# Altium schematic sheet 04-External_Connectors.SchDoc
size A4; Author: Fabian Castaño; CompanyName: GIBIC Tech-Hub; Engineer: Fabian Castaño; Organization: Universidad de Antioquia; Address1: UdeA; Address2: Medellín; Address3: Antioquia; Address4: Colombia 050010
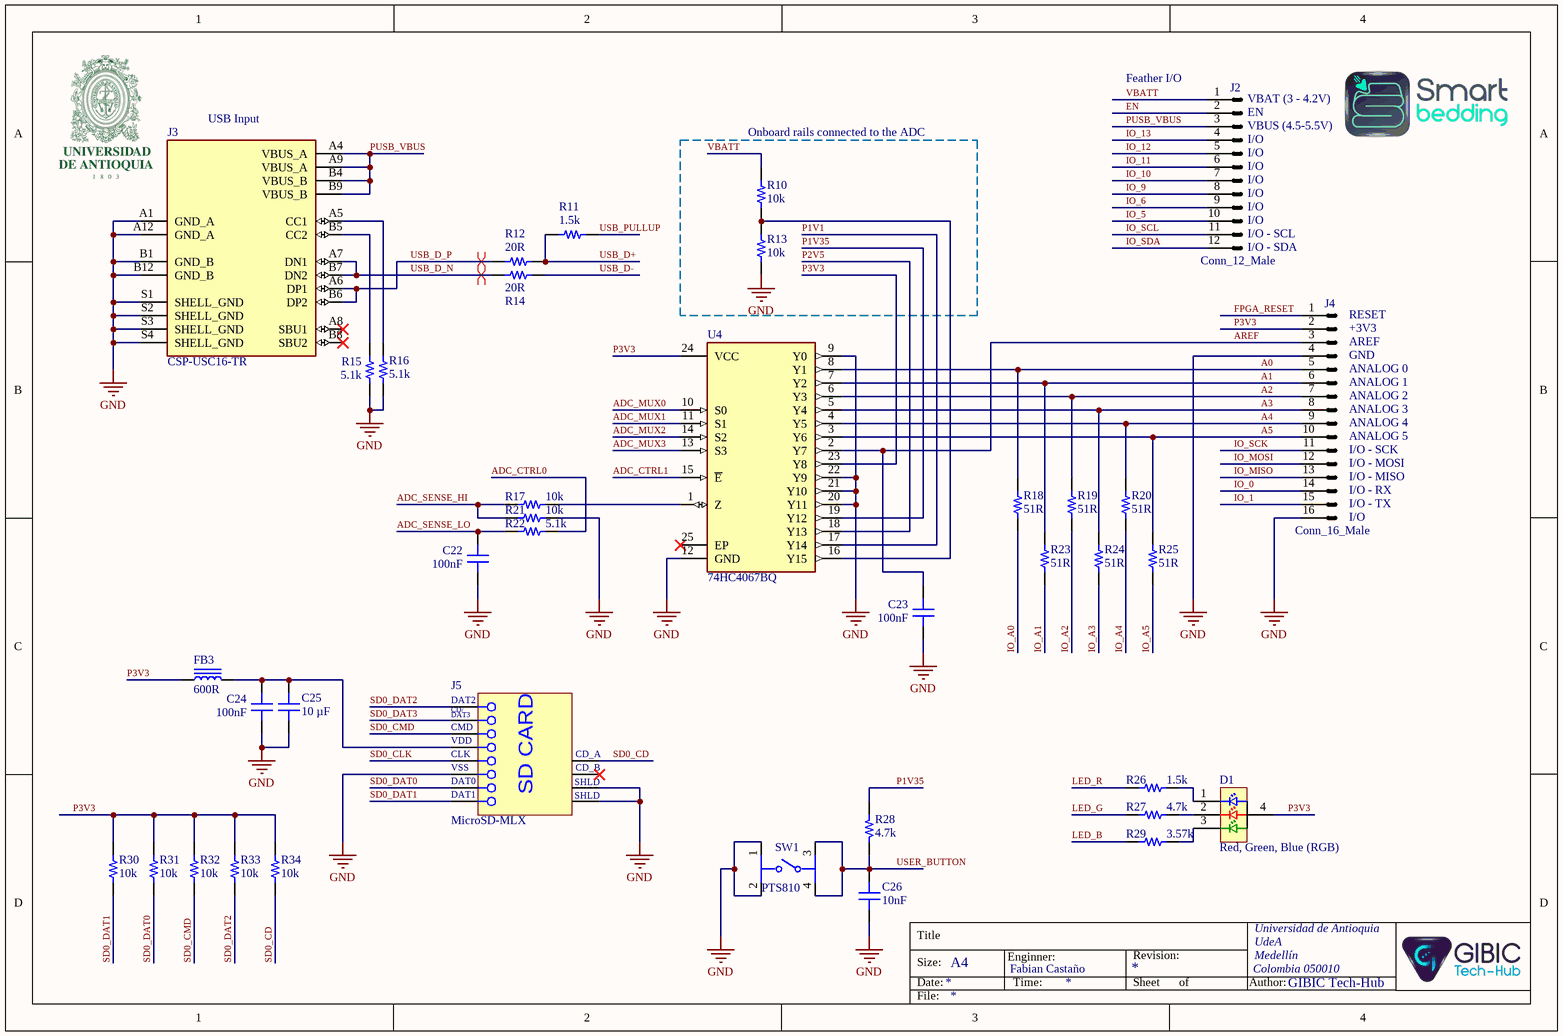
[diagram p0: 04-External_Connectors.SchDoc]

## Parts
C22  100nF  [CAP 0201_0603]
C23  100nF  [CAP 0201_0603]
C24  100nF  [CAP 0201_0603]
C25  10 µF  [CAP 0402_1005]
C26  10nF  [CAP 0201_0603]
D1  Red, Green, Blue (RGB)  [Citizen CL-505S-X-SD-T]
FB3  600R  [IND 0402_1005 RF WW]
J2  Conn_12_Male  [Conn_12_Male]
J3  CSP-USC16-TR  [VALCON_CSP-USC16-TR]
J4  Conn_16_Male  [CONN_16_MALE]
J5  MicroSD-MLX  [MOLEX-MicroSd]
R10  10k  [RES 0201_0603]
R11  1.5k  [RES 0201_0603]
R12  20R  [RES 0201_0603]
R13  10k  [RES 0201_0603]
R14  20R  [RES 0201_0603]
R15  5.1k  [RES 0201_0603]
R16  5.1k  [RES 0201_0603]
R17  10k  [RES 0201_0603]
R18  51R  [RES 0201_0603]
R19  51R  [RES 0201_0603]
R20  51R  [RES 0201_0603]
R21  10k  [RES 0201_0603]
R22  5.1k  [RES 0201_0603]
R23  51R  [RES 0201_0603]
R24  51R  [RES 0201_0603]
R25  51R  [RES 0201_0603]
R26  1.5k  [RES 0201_0603]
R27  4.7k  [RES 0201_0603]
R28  4.7k  [RES 0201_0603]
R29  3.57k  [RES 0201_0603]
R30  10k  [RES 0201_0603]
R31  10k  [RES 0201_0603]
R32  10k  [RES 0201_0603]
R33  10k  [RES 0201_0603]
R34  10k  [RES 0201_0603]
SW1  PTS810  [PCBComponent_1]
U4  74HC4067BQ  [QFN50P550X350X100-25N410X210]

## Blocks framed on the sheet
Onboard rails connected to the ADC: R10 R13

## Nets
GND: C22.1 C23.1 C24.1 C25.1 C26.1 J3.A1(GND_A) J3.A12(GND_A) J3.B1(GND_B) J3.B12(GND_B) J3.S1(SHELL_GND) J3.S2(SHELL_GND) J3.S3(SHELL_GND) J3.S4(SHELL_GND) J4.4 J4.16 J5.6(VSS) J5.11(SHLD1) J5.12(SHLD2) R13.1 R15.1 R16.1 R21.1 SW1.1 SW1.2 U4.9(Y0) U4.12(GND) U4.20(Y11) U4.21(Y10) U4.22(Y9)
A0: J4.5 R18.2 U4.8(Y1)
A1: J4.6 R23.2 U4.7(Y2)
A2: J4.7 R19.2 U4.6(Y3)
A3: J4.8 R24.2 U4.5(Y4)
A4: J4.9 R20.2 U4.4(Y5)
A5: J4.10 R25.2 U4.3(Y6)
ADC_CTRL0: R22.1
ADC_CTRL1: U4.15(~{E})
ADC_MUX0: U4.10(S0)
ADC_MUX1: U4.11(S1)
ADC_MUX2: U4.14(S2)
ADC_MUX3: U4.13(S3)
ADC_SENSE_HI: R17.2 R21.2
ADC_SENSE_LO: C22.2 R22.2
AREF: C23.2 J4.3 U4.2(Y7)
EN: J2.2
FPGA_RESET: J4.1
IO_0: J4.14
IO_1: J4.15
IO_5: J2.10
IO_6: J2.9
IO_9: J2.8
IO_10: J2.7
IO_11: J2.6
IO_12: J2.5
IO_13: J2.4
IO_A0: R18.1
IO_A1: R23.1
IO_A2: R19.1
IO_A3: R24.1
IO_A4: R20.1
IO_A5: R25.1
IO_MISO: J4.13
IO_MOSI: J4.12
IO_SCK: J4.11
IO_SCL: J2.11
IO_SDA: J2.12
LED_B: R29.2
LED_G: R27.2
LED_R: R26.2
P1V1: U4.17(Y14)
P1V35: R28.2 U4.19(Y12)
P2V5: U4.18(Y13)
P3V3: D1.4(A3) FB3.1 J4.2 R30.2 R31.2 R32.2 R33.2 R34.2 U4.23(Y8) U4.24(VCC)
PUSB_VBUS: J2.3 J3.A4(VBUS_A) J3.A9(VBUS_A) J3.B4(VBUS_B) J3.B9(VBUS_B)
SD0_CD: J5.9(CD_A) R34.1
SD0_CLK: J5.5(CLK)
SD0_CMD: J5.3(CMD) R32.1
SD0_DAT0: J5.7(DAT0) R31.1
SD0_DAT1: J5.8(DAT1) R30.1
SD0_DAT2: J5.1(DAT2) R33.1
SD0_DAT3: J5.2(CD/DAT3)
USB_D+: R11.2 R12.1
USB_D-: R14.1
USB_D_N: J3.A7(DN1) J3.B7(DN2) R14.2
USB_D_P: J3.A6(DP1) J3.B6(DP2) R12.2
USB_PULLUP: R11.1
USER_BUTTON: C26.2 R28.1 SW1.3 SW1.4
VBATT: J2.1 R10.2
NetC24_2: C24.2 C25.2 FB3.2 J5.4(VDD)
NetD1_1: D1.1(C1) R26.1
NetD1_2: D1.2(C2) R27.1
NetD1_3: D1.3(C3) R29.1
NetJ3_A5: J3.A5(CC1) R16.2
NetJ3_B5: J3.B5(CC2) R15.2
NetR10_1: R10.1 R13.2 U4.16(Y15)
NetR17_1: R17.1 U4.1(Z)

Not connected (* = marked no-connect by the designer): J3 A8(SBU1)* B8(SBU2)*; J5 10(CD_B)*; U4 25(EP)*

## Layout directives
differential pair: USB_D_N, USB_D_P

## Notes on the sheet
- (near J2) Feather I/O
- (near J2) VBAT (3 - 4.2V)
- (near J2) EN
- (near J3) USB Input
- (near J2) VBUS (4.5-5.5V)
- (near J2) I/O
- (near J2) I/O - SCL
- (near J2) I/O - SDA
- (near J4) RESET
- (near J4) +3V3
- (near J4) AREF
- (near J4) GND
- (near J4) ANALOG 0
- (near J4) ANALOG 1
- (near J4) ANALOG 2
- (near J4) ANALOG 3
- (near J4) ANALOG 4
- (near J4) ANALOG 5
- (near J4) I/O - SCK
- (near J4) I/O - MOSI
- (near J4) I/O - MISO
- (near J4) I/O - RX
- (near J4) I/O - TX
- (near J4) I/O
- Title
- Size:
- Date:
- A4
- Enginner:
- Time:
- Revision:
- Sheet
- of
- Author:
- File:
- (in symbol MicroSD-MLX) CD/; DAT3; SHLD; SD CARD

## Library data of the parts
C22-C24 = GRT033C80J104KE01J: CAP CER 0.1UF 6.3V X6S 0201; manufacturer: Murata Electronics; Capacitance: 0.1 µF; Tolerance: ±10%; Part Number: GRT033C80J104KE01J; Value: 100nF; Applications: Automotive; componentlink1description: Datasheet; componentlink1url: https://search.murata.co.jp/Ceramy/image/img/A01X/G101/ENG/GRT033C80J104KE01-01.pdf; componentlink2description: DigiKey Link; componentlink2url: https://www.digikey.com/en/products/detail/murata-electronics/GRT033C80J104KE01J/13905086; Device Package: 0201 (0603 Metric); lastupdated: 3/01/2023 8:00:58 p. m.; Lifecycle Status: Active; Minimum Order: 1; Mounting Type: Surface Mount, MLCC; Operating Temperature: -55°C ~ 105°C; Package / Case: 0201 (0603 Metric); packaging: CutTape; partid: 29730; Part Status: Active; price: 0.01; Ratings: AEC-Q200; series: GRT; Size / Dimension: 0.024" L x 0.012" W (0.60mm x 0.30mm); Supplier 1: DigiKey; Supplier Part Number 1: 490-GRT033C80J104KE01JCT-ND; Temperature Coefficient: X6S; Thickness (Max): 0.013" (0.33mm); Voltage - Rated: 6.3V
C25 = CL05A106MP8NUB8: CAP CER 10UF 10V X5R 0402; manufacturer: Samsung Electro-Mechanics; Tolerance: ±20%; Part Number: CL05A106MP8NUB8; Value: 10 µF; Applications: Acoustic Noise Reduction; Capacitance: 10 µF; componentlink1description: Datasheet; componentlink1url: http://www.samsungsem.com/kr/support/product-search/mlcc/CL05A106MP8NUB8.jsp; componentlink2description: DigiKey Link; componentlink2url: https://www.digikey.com/en/products/detail/samsung-electro-mechanics/CL05A106MP8NUB8/5961314; Device Package: 0402 (1005 Metric); lastupdated: 3/01/2023 8:04:20 p. m.; Lifecycle Status: Active; Minimum Order: 1; Mounting Type: Surface Mount, MLCC; Operating Temperature: -55°C ~ 85°C; Package / Case: 0402 (1005 Metric); packaging: TapeAndReel; partid: 1758; Part Status: Active; price: 0.06; series: CL; Size / Dimension: 0.039" L x 0.020" W (1.00mm x 0.50mm); Supplier 1: DigiKey; Supplier Part Number 1: 1276-6830-1-ND; Temperature Coefficient: X5R; Thickness (Max): 0.035" (0.90mm); Voltage - Rated: 10V
C26 = 0201ZC103JAT2A: CAP CER 10000PF 10V X7R 0201; manufacturer: AVX Corporation; Tolerance: ±5%; Part Number: 0201ZC103JAT2A; Value: 10nF; Applications: General Purpose; Capacitance: 10000pF; componentlink1description: Datasheet; componentlink1url: http://datasheets.avx.com/X7RDielectric.pdf; componentlink2description: DigiKey Link; componentlink2url: http://digikey.com/product-detail/en/avx-corporation/0201ZC103JAT2A/478-10776-1-ND/7536320; Device Package: 0201 (0603 Metric); lastupdated: 2/09/2020 12:59:12 a. m.; Lifecycle Status: Active; Minimum Order: 1; Mounting Type: Surface Mount, MLCC; Operating Temperature: -55°C ~ 125°C; Package / Case: 0201 (0603 Metric); packaging: TapeAndReel; partid: 786; Part Status: Active; price: 0.01; series: -; Size / Dimension: 0.024" L x 0.012" W (0.60mm x 0.30mm); Supplier 1: DigiKey; Supplier Part Number 1: 478-10776-1-ND; Temperature Coefficient: X7R; Thickness (Max): 0.013" (0.33mm); Voltage - Rated: 10V
D1 = CL-505S-X-SD-T: LED TRI TOP FIRING 1.0 X 1.0; Manufacturer: Citizen; Configuration: Common Anode; Current - Test: 5mA Red, 5mA Green, 5mA Blue; Lens Color: 0.26mm; Lens Size: 1.00mm; Lens Style: Square with Flat Top; Millicandela Rating: 40mcd Red, 220mcd Green, 65mcd Blue; Voltage - Forward (Vf) (Typ): 1.85V Red, 2.7V Green, 2.75V Blue; Wavelength - Dominant: 615nm Red, 530nm Green, 470nm Blue; Part Number: CL-505S-X-SD-T; Color: Red, Green, Blue (RGB); ComponentLink1Description: Datasheet; ComponentLink1URL: http://ce.citizen.co.jp/up_img/product/sQNrj4RlM7o2/CL-505S_e.pdf; ComponentLink2Description: DigiKey Link; ComponentLink2URL: http://digikey.com/product-detail/en/citizen/CL-505S-X-SD-T/1642-1510-1-ND/6005950; Device Package: 0404 (1010 Metric); Height (Max): 0.26mm; LastUpdated: 19/03/2020 10:25:23 p. m.; Lifecycle Status: Active; Minimum Order: 1; Mounting Type: Surface Mount; Package / Case: 0404 (1010 Metric); Packaging: TapeAndReel; PartId: 955; Part Status: Active; Price: 0.23; Series: CL-505S; Size / Dimension: 1.00mm L x 1.00mm W; Supplier 1: DigiKey; Supplier Part Number 1: 1642-1510-1-ND; Value: Red, Green, Blue (RGB)
FB3 = LQW15AN4N8D8ZD: FIXED IND 4.8NH 1.2A 71MOHM SMD; Manufacturer: Murata Electronics; DC Resistance (DCR): 71mOhm Max; Frequency - Self Resonant: 8GHz; Inductance Frequency - Test: 100 MHz; Material - Core: Non-Magnetic; Q @ Freq: 30 @ 250MHz; Shielding: Unshielded; Tolerance: ±0.5nH; Type: Wirewound; Part Number: LQW15AN4N8D8ZD; ComponentLink1Description: Datasheet; ComponentLink1URL: https://search.murata.co.jp/Ceramy/image/img/P02/JELF243A-9138.pdf; ComponentLink2Description: DigiKey Link; ComponentLink2URL: https://www.digikey.com/en/products/detail/murata-electronics/LQW15AN4N8D8ZD/6798910; Current Rating (Amps): 1.2 A; Device Package: 0402 (1005 Metric); Height - Seated (Max): 0.024" (0.60mm); Inductance: 4.8 nH; LastUpdated: 2/01/2023 8:59:34 p. m.; Lifecycle Status: Active; Minimum Order: 1; Mounting Type: Surface Mount; Operating Temperature: -55°C ~ 125°C; Package / Case: 0402 (1005 Metric); Packaging: TapeAndReel; PartId: 2; Part Status: Active; Price: 0.08; Ratings: AEC-Q200; Series: LQW15; Size / Dimension: 0.039" L x 0.024" W (1.00mm x 0.60mm); Supplier 1: DigiKey; Supplier Part Number 1: 490-15485-1-ND; Value: 600R
J2 = Conn_12_Male: Conn_01x12_Male
J3 = CSP-USC16-TR: CSP-USC16-TR Valcon USB Type C Surface Mount PCB Socket; Package: None; Purchase-URL: https://pricing.snapeda.com/search/part/CSP-USC16-TR/?ref=eda; MP: CSP-USC16-TR; Check_prices: https://www.snapeda.com/parts/CSP-USC16-TR/Valcon/view-part/4783629/?ref=eda; MF: Valcon; Value: *; Availability: No availability data; Price: None; SnapEDA_Link: https://www.snapeda.com/parts/CSP-USC16-TR/Valcon/view-part/4783629/?ref=snap
J4 = Conn_16_Male: Conn_01x16_Male
J5 = MicroSD-MLX: Micro SD Card, RA, -25 to 85 degC, 8-Pin SMD, RoHS
R10-R34 = ERA-1AEB103C: RES SMD 10K OHM 0.1% 1/20W 0201; Manufacturer: Panasonic Electronic Components; Power (Watts): 0.05W, 1/20W; Resistance: 10 kOhms; Temperature Coefficient: ±25ppm/°C; Part Number: ERA-1AEB103C; ComponentLink1Description: Datasheet; ComponentLink1URL: https://industrial.panasonic.com/cdbs/www-data/pdf/RDM0000/AOA0000C307.pdf; ComponentLink2Description: DigiKey Link; ComponentLink2URL: https://www.digikey.com/en/products/detail/panasonic-electronic-components/ERA-1AEB103C/5035568; Composition: Thin Film; Device Package: 0201 (0603 Metric); Features: Automotive AEC-Q200; Height - Seated (Max): 0.010" (0.26mm); LastUpdated: 3/01/2023 8:15:23 p. m.; Lifecycle Status: Active; Minimum Order: 1; Number of Terminations: 2; Operating Temperature: -55°C ~ 155°C; Package / Case: 0201 (0603 Metric); Packaging: TapeAndReel; PartId: 598; Part Status: Active; Price: 0.06; Ratings: AEC-Q200; Series: ERA-1A; Size / Dimension: 0.024" L x 0.012" W (0.60mm x 0.30mm); Supplier 1: DigiKey; Supplier Part Number 1: P10KBXCT-ND; Supplier Device Package: 0201; Tolerance: ±0.1%
  R10 R13 R17 R21 R30-R34: Value: 10k
  R11 R26: Value: 1.5k
  R12 R14: Value: 20R
  R15 R16 R22: Value: 5.1k
  R18-R20 R23-R25: Value: 51R
  R27 R28: Value: 4.7k
  R29: Value: 3.57k
U4 = 74HC4067BQ: 1 Circuit IC Switch 16:1 120Ohm 24-DHVQFN _5.5x3.5_; MF: Nexperia USA; Availability: Unavailable; SnapEDA_Link: https://www.snapeda.com/parts/74HC4067BQ/Nexperia%20USA%20Inc./view-part/602696/?ref=snap; Price: None; Package: DHVQFN-24 Nexperia; MP: 74HC4067BQ; Value: *